# EAGLE design SB_A005 (EAGLE 7.4.0)
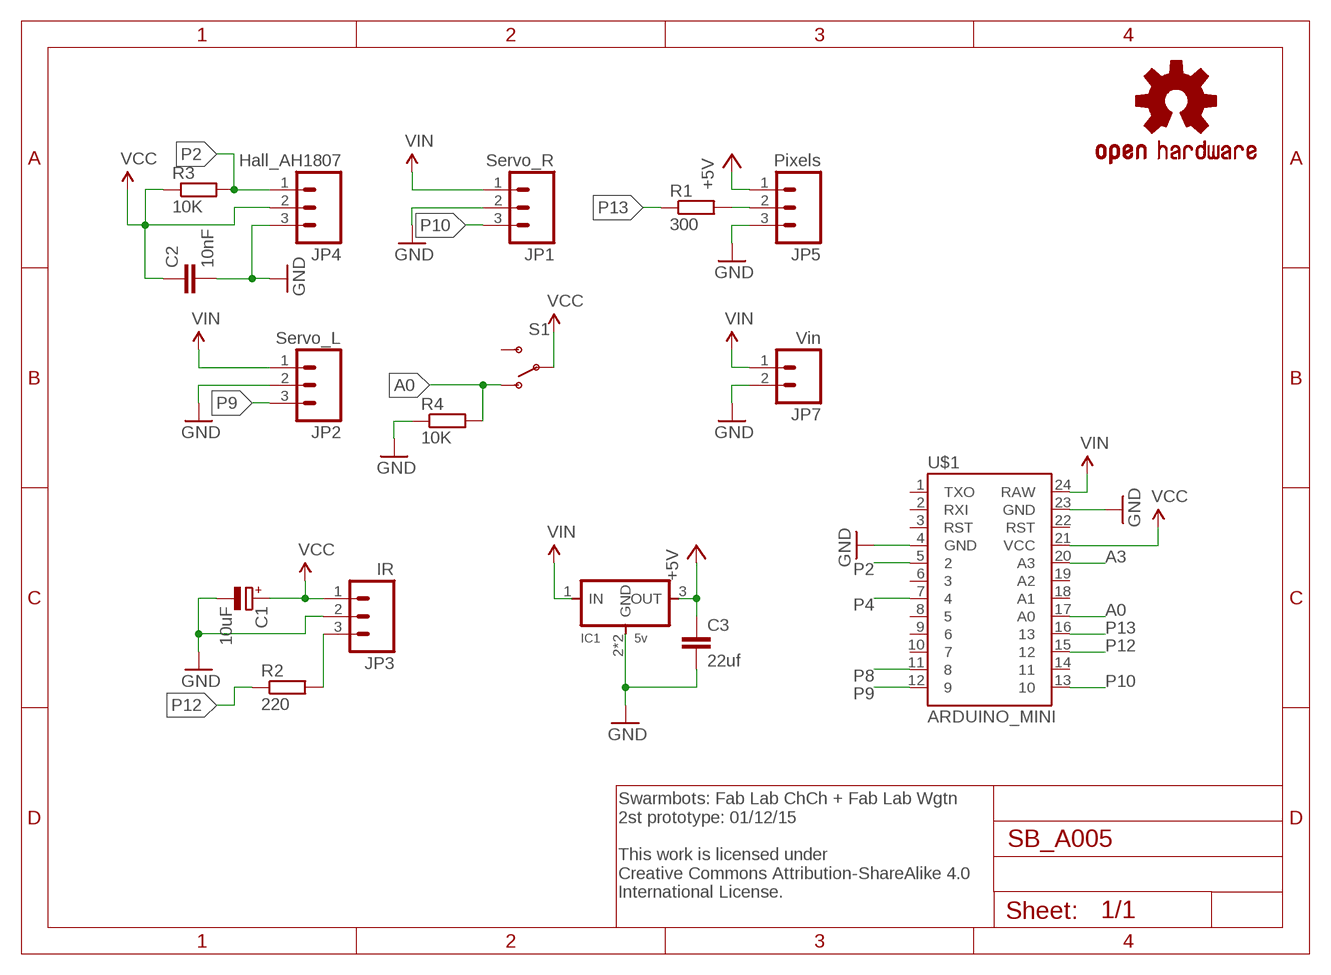
[diagram p0: schematic, sheet 1]

## Parts
C1  10uF  CPOL-EUC/6032-28R  [C/6032-28R]
C2  10nF  C-EUC1206  [C1206]
C3  22uf  C-EUC1206K  [C1206K]
IC1  5v  REGULATORSOT223  [SOT223]
JP1  Servo_R  M03LONGPADS  [1X03_LONGPADS]
JP2  Servo_L  M03LONGPADS  [1X03_LONGPADS]
JP3  IR  M031X03_NO_SILK  [1X03_NO_SILK]
JP4  Hall_AH1807  M031X03_NO_SILK  [1X03_NO_SILK]
JP5  Pixels  M03LONGPADS  [1X03_LONGPADS]
JP7  Vin  M02PTH3  [1X02_LONGPADS]
LOGO1  OSHW-LOGOS  [OSHW-LOGO-S]
R1  300  R-EU_M1206  [M1206]
R2  220  R-EU_M1206  [M1206]
R3  10K  R-EU_M1206  [M1206]
R4  10K  R-EU_M1206  [M1206]
S1  SWITCH-SPDTSMD2  [SWITCH-SPDT-SMD]
U$1  ARDUINO_MINI  [ARDUINO_MINI]

## Nets
+5V: C3.1 IC1.3(OUT) JP5.1
A0: R4.2 S1.1(O) U$1.17(A0)
A3: U$1.20(A3)
GND: C1.- C2.2 C3.2 IC1.2(GND) IC1.4(GND) JP1.2 JP2.2 JP3.2 JP4.3 JP5.3 JP7.2 R4.1 U$1.4(GND) U$1.23(GND)
N$3: JP3.3 R2.2
N$6: JP5.2 R1.2
P2: JP4.1 R3.2 U$1.5
P4: U$1.7
P8: U$1.11
P9: JP2.3 U$1.12
P10: JP1.3 U$1.13
P12: R2.1 U$1.15
P13: R1.1 U$1.16
VCC: C1.+ C2.1 JP3.1 JP4.2 R3.1 S1.2(P) U$1.21(VCC)
VIN: IC1.1(IN) JP1.1 JP2.1 JP7.1 U$1.24(RAW)
Unconnected: S1.3(S) U$1.1(TXO) U$1.2(RXI) U$1.3(RST) U$1.6 U$1.8 U$1.9 U$1.10 U$1.14 U$1.18(A1) U$1.19(A2) U$1.22(RST)

## Notes on the sheet
- Swarmbots: Fab Lab ChCh + Fab Lab Wgtn
  2st prototype: 01/12/15
  
  This work is licensed under
  Creative Commons Attribution-ShareAlike 4.0
  International License.

## Library data of the parts
C1 = rcl:CPOL-EU: POLARIZED CAPACITOR, European symbol
C2 C3 = rcl:C-EU: CAPACITOR, European symbol
IC1 = fab:REGULATOR
JP1-JP5 = SparkFun-Connectors:M03: Header 3 Standard 3-pin 0.1" header. Use with straight break away headers (SKU : PRT-00116), right angle break away headers (PRT-00553), swiss pins (PRT-00743), machine pins (PRT-00117), and female headers (PRT-00115). Molex polarized connector foot print use with SKU : PRT-08232 with associated crimp pins and housings.
JP7 = SparkFun-Connectors:M02: Standard 2-pin 0.1" header. Use with - straight break away headers ( PRT-00116) - right angle break away headers (PRT-00553) - swiss pins (PRT-00743) - machine pins (PRT-00117) - female headers (PRT-00115) Molex polarized connector foot print use with: PRT-08233 with associated crimp pins and housings. 2.54_SCREWTERM for use with PRT-10571. 3.5mm Screw Terminal footprints for PRT-08084 5mm Screw Terminal footprints for use with PRT-08432
LOGO1 = SparkFun-Aesthetics:OSHW-LOGO: Open Source Hardware Logo This logo indicates the piece of hardware it is found on incorporates a OSHW license and/or adheres to the definition of open source hardware found here: http://freedomdefined.org/OSHW
R1-R4 = rcl:R-EU_: RESISTOR, European symbol
S1 = SparkFun-Electromechanical:SWITCH-SPDT: SPDT Switch Simple slide switch, Spark Fun Electronics SKU : COM-00102 DPDT SMT slide switch, AYZ0202, SWCH-08179
U$1 = SparkFun-Boards:ARDUINO_MINI: Arduino Pro Mini footprint

## Board
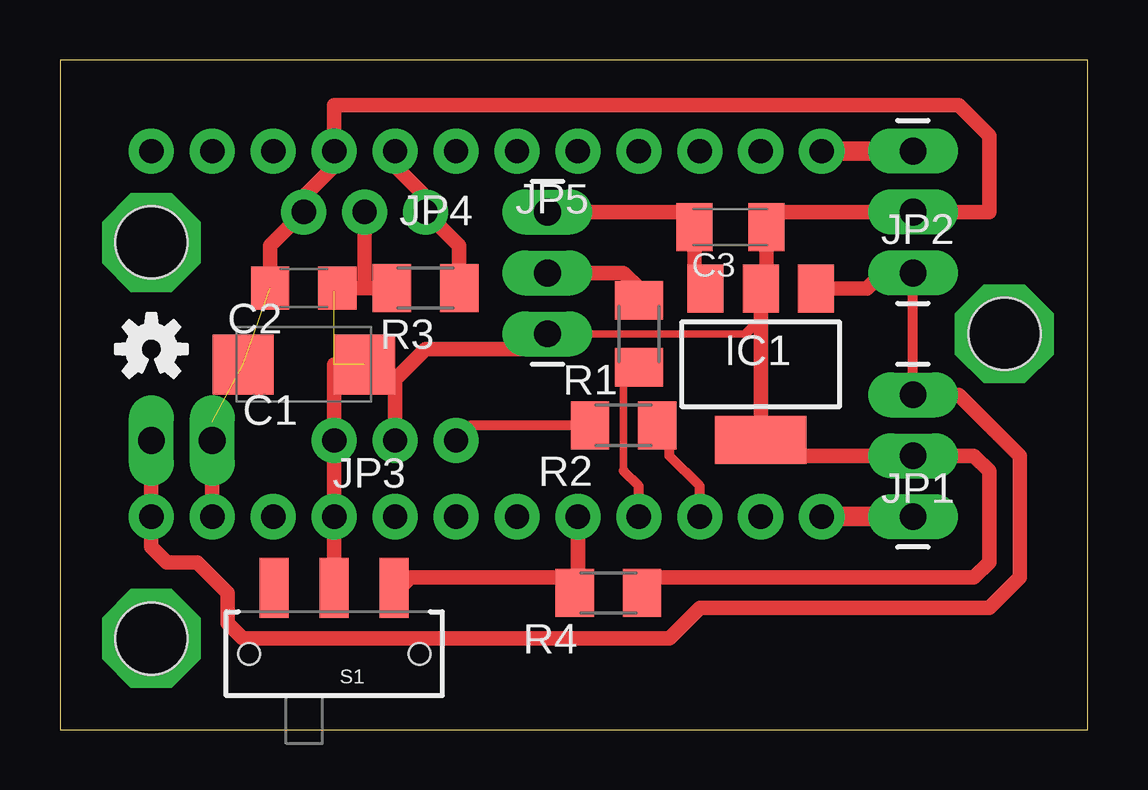
[diagram p1: board, top side]

Size 42.85 x 27.93 mm. Coordinates in mm from the lower left corner, seen from the top.
Outline: 0,0 42.85,0 42.85,27.93 0,27.93 0,0
Copper layers (1*16): Top 0.035mm / dielectric 1.5mm / Bottom 0.035mm
Design rules "fabmodule": minimum track width 10mil, minimum drill 0.4mm, track to track 0.42mm, track to pad 0.42mm, pad to pad 0.42mm, via to via 0.42mm, smd to smd 0.42mm, copper to edge 40mil, drill to drill 0.8mm, minimum pad ring 10mil, minimum via ring 8mil, stop-mask expansion 4mil, vias tented up to drill 0mil, thermal gap 10mil
Holes 3 mm at 3.81,20.32 3.81,3.81 39.37,16.51

### Footprints (pad centres in the part's own frame; a part is rotated, then mirrored left to right if it is on the bottom)
C/6032-28R = smd 2.55 x 2.5: + 2.525,0; - -2.525,0
C1206 = smd 1.6 x 1.8: 1 -1.4,0; 2 1.4,0
C1206K = smd 1.5 x 2: 1 -1.5,0; 2 1.5,0
SOT223 = smd 1.5 x 2: 1 -2.3,-3.15; 2 0,-3.15; 3 2.3,-3.15 | smd 3.8 x 2: 4 0,3.15
1X03_LONGPADS = drill 1.118 pad 1.88 long: 1 0,0; 2 2.54,0; 3 5.08,0
1X03_NO_SILK = drill 1.016 pad 1.88: 1 0,0; 2 2.54,0; 3 5.08,0
1X02_LONGPADS = drill 1.118 pad 1.88 long: 1 0,0; 2 2.54,0
M1206 = smd 1.6 x 2: 1 -1.4,0; 2 1.4,0
SWITCH-SPDT-SMD = smd 1.2 x 2.5: 1 -2.5,-2.75; 2 0,-2.75; 3 2.5,-2.75 | hole 0.9: -3.55,0; 3.55,0
ARDUINO_MINI = drill 1.016 pad 1.88: 1 -7.62,12.7; 2 -7.62,10.16; 3 -7.62,7.62; 4 -7.62,5.08; 5 -7.62,2.54; 6 -7.62,0; 7 -7.62,-2.54; 8 -7.62,-5.08; 9 -7.62,-7.62; 10 -7.62,-10.16; 11 -7.62,-12.7; 12 -7.62,-15.24; 13 7.62,-15.24; 14 7.62,-12.7; 15 7.62,-10.16; 16 7.62,-7.62; 17 7.62,-5.08; 18 7.62,-2.54; 19 7.62,0; 20 7.62,2.54; 21 7.62,5.08; 22 7.62,7.62; 23 7.62,10.16; 24 7.62,12.7

### Placement (x,y rotation side)
C1  10.16,15.24 0 top
C2  10.16,18.41 180 top
C3  27.94,20.95 0 top
IC1  29.21,15.24 180 top
JP1  35.56,13.97 270 top
JP2  35.56,19.05 90 top
JP3  11.43,12.06 0 top
JP4  15.24,21.59 180 top
JP5  20.32,21.59 270 top
JP7  3.81,12.06 0 top
LOGO1  3.81,15.88 0 top
R1  24.13,16.51 90 top
R2  23.5,12.7 180 top
R3  15.24,18.41 0 top
R4  22.86,5.71 180 top
S1  11.43,3.17 180 top
U$1  16.51,16.51 270 bottom

### Tracks (layer width: path | path; a pad name or v marks a point on that pad's centre or on a via)
+5V
  Top 0.61: IC1.3 26.44,18.86 C3.1 25.8,21.59 JP5.1
A0
  Top 0.61: U$1.17 21.59,6.35 | 21.59,6.35 21.59,5.84 R4.2 21.46,5.84 20.95,6.35 | S1.1 14.18,5.92 14.61,6.35 21.59,6.35
GND  (2 unrouted)
  Top 0.305: JP5.3 28.57,16.51
  Top 0.406: U$1.4 11.43,23.5 | 28.57,16.51 29.21,17.14 29.21,17.78 IC1.2
  Top 0.61: IC1.2 29.44,18.62 C3.2 29.21,21.18 29.21,21.59 JP2.2 38.73,21.59 38.73,24.77 37.47,26.04 11.43,26.04 11.43,23.5 10.16,22.23 JP4.3 8.76,20.19 C2.2 | U$1.23 JP7.2 6.35,12.83 | R4.1 24.26,5.84 24.77,6.35 38.1,6.35 38.73,6.99 38.73,10.79 38.1,11.43 37.47,11.43 36.83,11.43 JP1.2 29.87,11.43 IC1.4 29.21,17.78 | JP3.2 13.97,14.61 15.24,15.88 19.68,15.88 JP5.3
N$1  (via drill 3.1)
  other vias: 3.81,3.81
N$2  (via drill 3.1)
  other vias: 39.37,16.51
N$3
  Top 0.406: R2.2 17.14,12.7 JP3.3
N$4  (via drill 3.1)
  other vias: 3.81,20.32
N$6
  Top 0.61: JP5.2 23.5,19.05 24.13,18.41 R1.2
P2
  Top 0.61: R3.2 16.64,20.19 JP4.1 15.24,22.23 13.97,23.5 U$1.5
P9
  Top 0.813: JP2.3 U$1.12
P10
  Top 0.813: JP1.3 U$1.13
P12
  Top 0.406: U$1.15 26.67,10.16 25.4,11.43 25.4,12.2 R2.1
P13
  Top 0.305: 23.5,10.79 23.5,14.47
  Top 0.406: U$1.16 24.13,10.16 23.5,10.79 | 23.5,14.47 R1.1
VCC  (2 unrouted)
  Top 0.406: 11.43,18.29 C2.1
  Top 0.61: C2.1 12.7,18.41 | 12.7,18.41 R3.1 | JP4.2 12.7,18.41 | 11.3,18.29 11.43,18.29 11.56,18.29 | 11.43,15.24 JP3.1 U$1.21 S1.2
VIN
  Top 0.406: JP1.1 JP2.1
  Top 0.61: IC1.1 33.63,18.39 34.29,19.05 JP2.1 | U$1.24 JP7.1 3.81,7.62 4.45,6.99 5.71,6.99 6.99,5.71 6.99,4.45 7.62,3.81 25.4,3.81 26.67,5.08 38.73,5.08 40.01,6.35 40.01,11.43 37.47,13.97 JP1.1 36.83,13.97